# EAGLE design mapleCUx_large_085-MAPLE-unten (EAGLE 7.3.0)
MAPLE-CUx Large Version
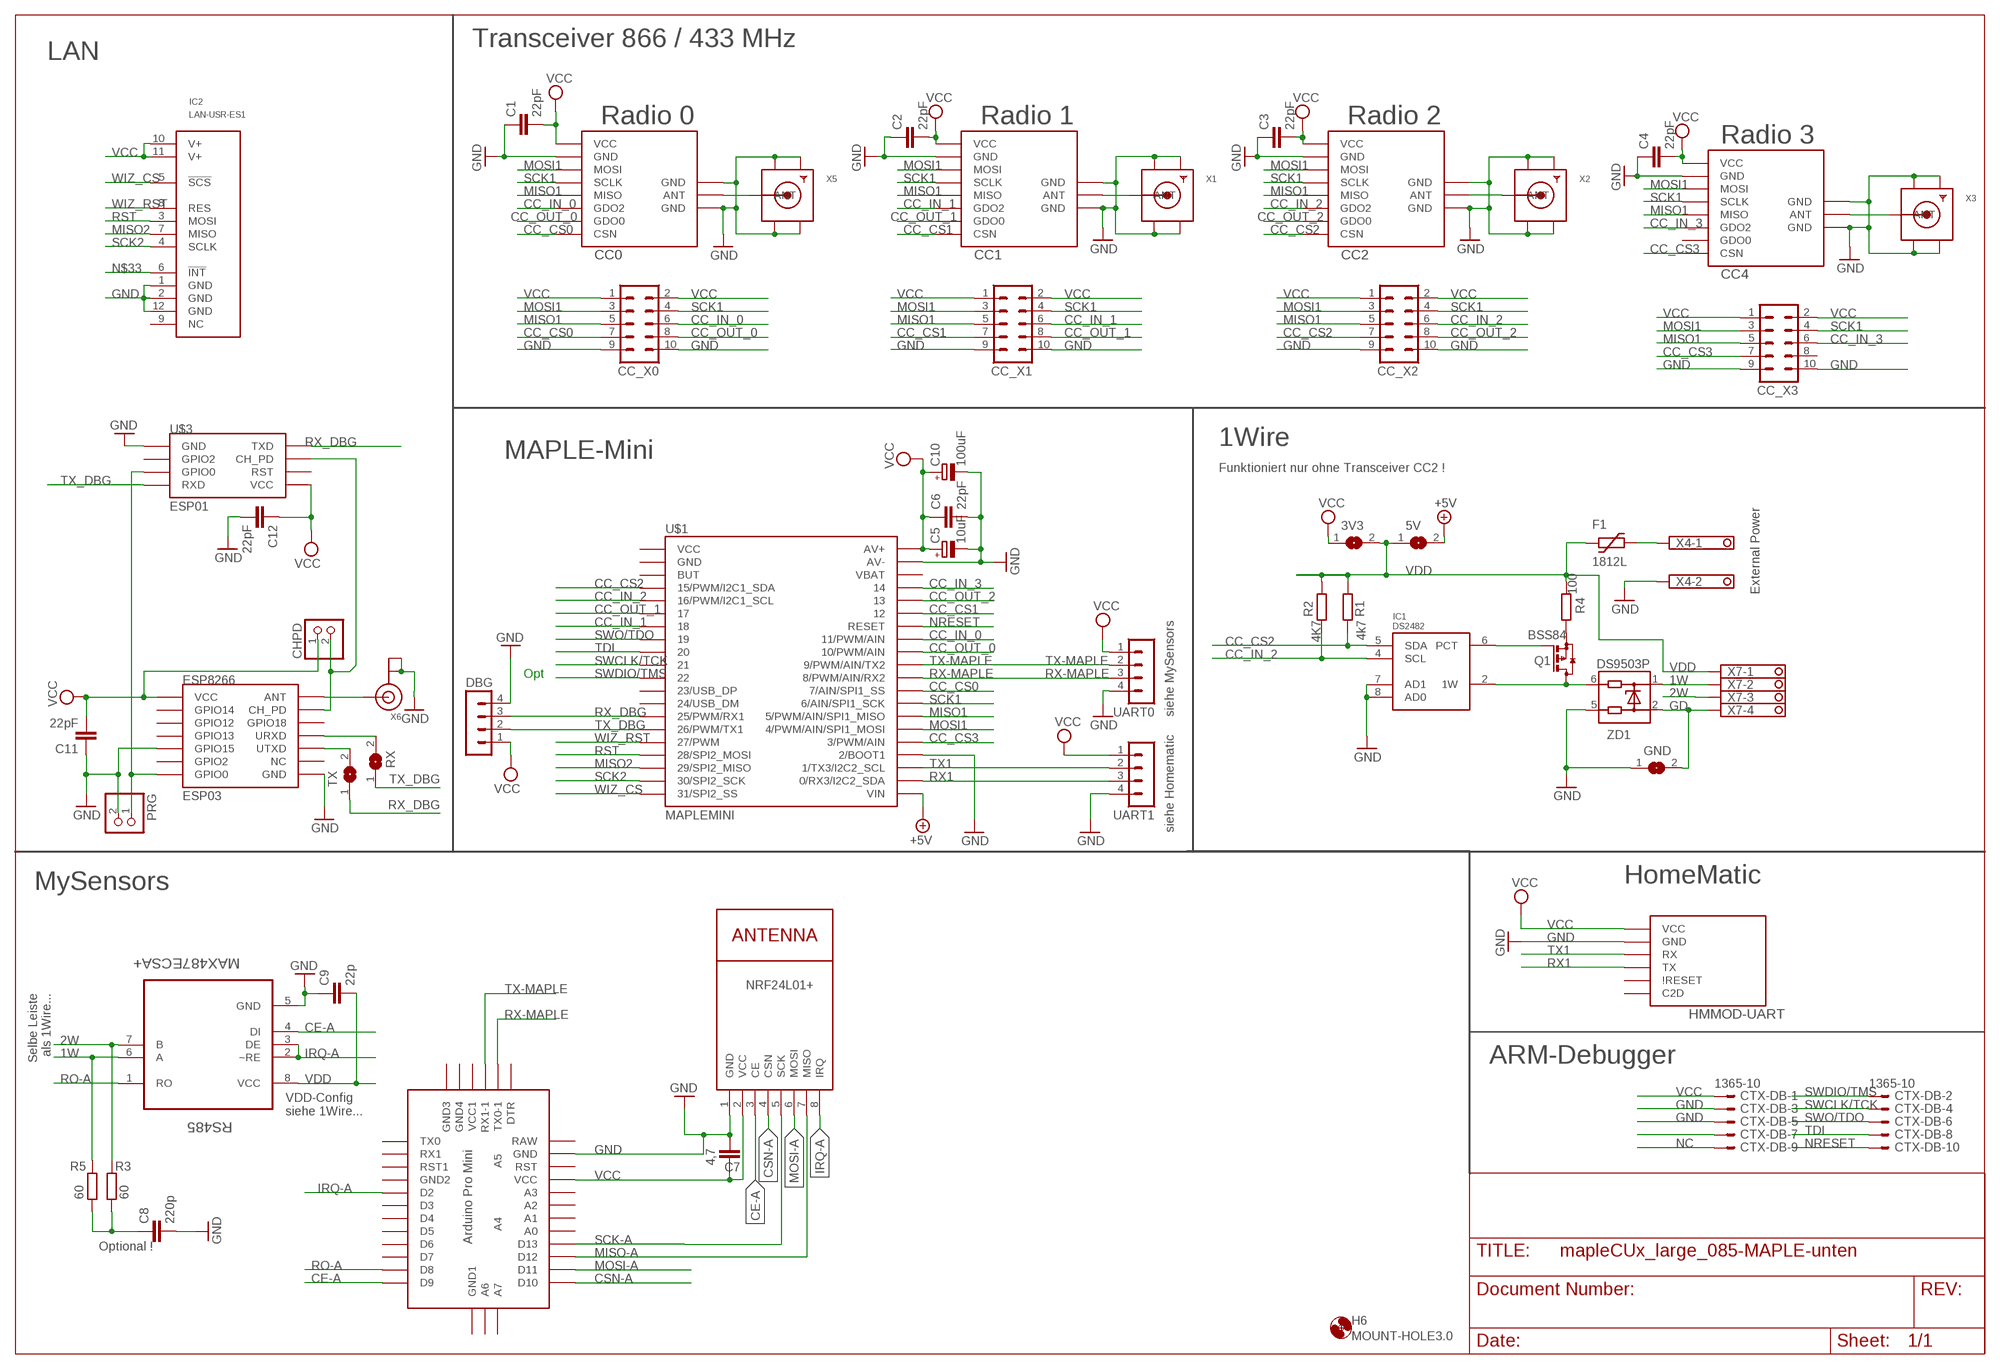
[diagram p0: schematic, sheet 1]

## Parts
3V3  SJ  [SJ]
5V  SJ  [SJ]
C1  22pF  C-EUC0805  [C0805]
C2  22pF  C-EUC0805  [C0805]
C3  22pF  C-EUC0805  [C0805]
C4  22pF  C-EUC0805  [C0805]
C5  10uF  CPOL-EUR/2012-12W  [R/2012-12W]
C6  22pF  C-EUC0805  [C0805]
C7  4,7  C-EUC1210  [C1210]
C8  220p  C-EUC0805  [C0805]
C9  22p  C-EUC0805  [C0805]
C10  100uF  CPOL-EUE5-8.5  [E5-8,5]
C11  22pF  C-EUC0805  [C0805]
C12  22pF  C-EUC0805  [C0805]
CC0  CC1101  CC1101_MODULE1SMD  [CC1101_MODULE1_SMD]
CC1  CC1101_MODULE1SMD  [CC1101_MODULE1_SMD]
CC2  CC1101_MODULE1SMD  [CC1101_MODULE1_SMD]
CC4  CC1101_MODULE1SMD  [CC1101_MODULE1_SMD]
CC_X0  MA05-2  [MA05-2]
CC_X1  MA05-2  [MA05-2]
CC_X2  MA05-2  [MA05-2]
CC_X3  MA05-2  [MA05-2]
CHPD  PINHD-1X2  [1X02]
CTX-DB  1365-10  [1365-10]
DBG  MA04-1  [MA04-1]
ESP8266  ESP03  [ESP03]
F1  1812L  [1812L]
GND  SJ  [SJ]
H6  MOUNT-HOLE3.0  [3,0]
HMMOD-UART  HM-MOD-UARTDIL  [HM-MOD-UART-DIL]
IC1  DS2482  DS2482-100S  [SO08]
IC2  LAN-USR-ES1  [USR-ES1]
NRF24L01+  NRF24L01+  WIRELESS-NRF24L01  [WIRELESS-NRF24L01]
PRG  PINHD-1X2  [1X02]
Q1  BSS84  [SOT23]
R1  4k7  R-EU_R0805  [R0805]
R2  4K7  R-EU_R0805  [R0805]
R3  60  R-EU_R0805  [R0805]
R4  100  R-EU_R0805  [R0805]
R5  60  R-EU_R0805  [R0805]
RS485  MAX487ECSA+  [SOIC127P600X175-8N]
RX  SJ  [SJ]
TX  SJ  [SJ]
U$1  MAPLEMINI  [20-DIP]
U$2  ABK-PRO-MINI  [ABK-PRO-MINI]
U$3  ESP01  [ESP01]
UART0  MA04-1  [MA04-1]
UART1  MA04-1  [MA04-1]
X1  SMACONNECTOR_EDGE_UFL  [SMA_EDGELAUNCH_UFL]
X2  SMACONNECTOR_EDGE_UFL  [SMA_EDGELAUNCH_UFL]
X3  SMACONNECTOR_EDGE_UFL  [SMA_EDGELAUNCH_UFL]
X4  1751248  [1751248]
X5  SMACONNECTOR_EDGE_UFL  [SMA_EDGELAUNCH_UFL]
X6  ANTENNA_U.FL  [U.FL]
X7  1751264  [1751264]
ZD1  DS9503P  [TSOC6]

## Nets
1W: R5.2 RS485.6(A) X7.2 ZD1.1
2W: R3.2 RS485.7(B) X7.3
+5V [PWR]: 5V.2 U$1.21(VIN)
CC_CS0: CC0.CSN CC_X0.7 U$1.29(7/AIN/SPI1_SS)
CC_CS1: CC1.CSN CC_X1.7 U$1.35
CC_CS2: CC2.CSN CC_X2.7 IC1.5(SDA) R1.2 U$1.4(15/PWM/I2C1_SDA)
CC_CS3: CC4.CSN CC_X3.7 U$1.25(3/PWM/AIN)
CC_IN_0: CC0.GDO2 CC_X0.6 U$1.33(11/PWM/AIN)
CC_IN_1: CC1.GDO2 CC_X1.6 U$1.7
CC_IN_2: CC2.GDO2 CC_X2.6 IC1.4(SCL) R2.2 U$1.5(16/PWM/I2C1_SCL)
CC_IN_3: CC4.GDO2 CC_X3.6 U$1.37
CC_OUT_0: CC0.GDO0 CC_X0.8 U$1.32(10/PWM/AIN)
CC_OUT_1: CC1.GDO0 CC_X1.8 U$1.6
CC_OUT_2: CC2.GDO0 CC_X2.8 U$1.36
CE-A: NRF24L01+.3(CE) RS485.4(DI) U$2.D9
CSN-A: NRF24L01+.4(CSN) U$2.D10
GD [PWR]: GND.2 X7.4 ZD1.2
GND [PWR]: C1.1 C2.1 C3.1 C4.1 C5.- C6.2 C7.1 C8.2 C9.1 C10.- C11.1 C12.2 CC0.GND@0(GND) CC0.GND@1(GND) CC0.GND@2(GND) CC1.GND@0(GND) CC1.GND@1(GND) CC1.GND@2(GND) CC2.GND@0(GND) CC2.GND@1(GND) CC2.GND@2(GND) CC4.GND@0(GND) CC4.GND@1(GND) CC4.GND@2(GND) CC_X0.9 CC_X0.10 CC_X1.9 CC_X1.10 CC_X2.9 CC_X2.10 CC_X3.9 CC_X3.10 CTX-DB.3 CTX-DB.5 DBG.4 ESP8266.GND ESP8266.GPIO15 GND.1 HMMOD-UART.2(GND) IC1.7(AD1) IC1.8(AD0) IC2.1(GND) IC2.2(GND) IC2.12(GND) NRF24L01+.1(GND) PRG.2 RS485.5(GND) U$1.24(2/BOOT1) U$1.39(AV-) U$2.GND U$3.GND UART0.4 UART1.4 X1.GND@1(GND1) X1.GND@2(GND2) X1.GND@3(GND3) X1.GND@4(GND4) X2.GND@1(GND1) X2.GND@2(GND2) X2.GND@3(GND3) X2.GND@4(GND4) X3.GND@1(GND1) X3.GND@2(GND2) X3.GND@3(GND3) X3.GND@4(GND4) X4.2 X5.GND@1(GND1) X5.GND@2(GND2) X5.GND@3(GND3) X5.GND@4(GND4) X6.1(GND) X6.2(GND) ZD1.5
IRQ-A: NRF24L01+.8(IRQ) RS485.2(~RE) RS485.3(DE) U$2.D2
MISO1: CC0.MISO CC1.MISO CC2.MISO CC4.MISO CC_X0.5 CC_X1.5 CC_X2.5 CC_X3.5 U$1.27(5/PWM/AIN/SPI1_MISO)
MISO2: IC2.7(MISO) U$1.18(29/SPI2_MISO)
MISO-A: NRF24L01+.7(MISO) U$2.D12
MOSI1: CC0.MOSI CC1.MOSI CC2.MOSI CC4.MOSI CC_X0.3 CC_X1.3 CC_X2.3 CC_X3.3 U$1.26(4/PWM/AIN/SPI1_MOSI)
MOSI-A: NRF24L01+.6(MOSI) U$2.D11
N$1: CC1.ANT X1.P(ANT)
N$2: CC4.ANT X3.P(ANT)
N$3: CC2.ANT X2.P(ANT)
N$4: CC0.ANT X5.P(ANT)
N$8: CTX-DB.7
N$11: ESP8266.GPIO0 PRG.1 U$3.GPIO0
N$12: ESP8266.ANT X6.3(SIGNAL)
N$17: CHPD.2 ESP8266.CH_PD U$3.CH_PD
N$18: ESP8266.URXD RX.2
N$19: ESP8266.UTXD TX.2
N$21: C8.1 R3.1 R5.1
N$33: IC2.6(!INT!)
N$45 [PWR]: F1.P$2 X4.1
N$47: IC1.6(PCT) Q1.1(G)
N$48: IC1.2(1W) Q1.3(D) ZD1.6
N$52: Q1.2(S) R4.1
NC: CTX-DB.9
NRESET: CTX-DB.10 U$1.34(RESET)
RO-A: RS485.1(RO) U$2.D8
RST: IC2.3(MOSI) U$1.17(28/SPI2_MOSI)
RX1: HMMOD-UART.5(TX) U$1.22(0/RX3/I2C2_SDA) UART1.3
RX-MAPLE: U$1.30(8/PWM/AIN/RX2) U$2.TX0-1 UART0.3
RX_DBG: DBG.3 TX.1 U$1.14(25/PWM/RX1) U$3.TX(TXD)
SCK1: CC0.SCLK CC1.SCLK CC2.SCLK CC4.SCLK CC_X0.4 CC_X1.4 CC_X2.4 CC_X3.4 U$1.28(6/AIN/SPI1_SCK)
SCK2: IC2.4(SCLK) U$1.19(30/SPI2_SCK)
SCK-A: NRF24L01+.5(SCK) U$2.D13
SWCLK/TCK: CTX-DB.4 U$1.10
SWDIO/TMS: CTX-DB.2 U$1.11
SWO/TDO: CTX-DB.6 U$1.8
TDI: CTX-DB.8 U$1.9
TX1: HMMOD-UART.6(RX) U$1.23(1/TX3/I2C2_SCL) UART1.2
TX-MAPLE: U$1.31(9/PWM/AIN/TX2) U$2.RX1-1 UART0.2
TX_DBG: DBG.2 RX.1 U$1.15(26/PWM/TX1) U$3.RX(RXD)
VCC [PWR]: 3V3.1 C1.2 C2.2 C3.2 C4.2 C5.+ C6.1 C7.2 C10.+ C11.2 C12.1 CC0.VCC CC1.VCC CC2.VCC CC4.VCC CC_X0.1 CC_X0.2 CC_X1.1 CC_X1.2 CC_X2.1 CC_X2.2 CC_X3.1 CC_X3.2 CHPD.1 CTX-DB.1 DBG.1 ESP8266.VCC HMMOD-UART.1(VCC) IC2.10(V+) IC2.11(V+) NRF24L01+.2(VCC) U$1.40(AV+) U$2.VCC U$3.VCC UART0.1 UART1.1
VDD [PWR]: 3V3.2 5V.1 C9.2 F1.P$1 R1.1 R2.1 R4.2 RS485.8(VCC) X7.1
WIZ_CS: IC2.5(!SCS!) U$1.20(31/SPI2_SS)
WIZ_RST: IC2.8(RES) U$1.16(27/PWM)
Unconnected: CC4.GDO0 CC_X3.8 ESP8266.GPIO2 ESP8266.GPIO12 ESP8266.GPIO13 ESP8266.GPIO14 ESP8266.GPIO18 ESP8266.NC HMMOD-UART.3(C2D) HMMOD-UART.4(\!RESET) IC2.9(NC) U$1.1(VCC) U$1.2(GND) U$1.3(BUT) U$1.12(23/USB_DP) U$1.13(24/USB_DM) U$1.38(VBAT) U$2.A0 U$2.A1 U$2.A2 U$2.A3 U$2.A4 U$2.A5 U$2.A6 U$2.A7 U$2.D3 U$2.D4 U$2.D5 U$2.D6 U$2.D7 U$2.DTR U$2.GND1(GND2) U$2.GND2(GND3) U$2.GND3(GND4) U$2.GND4(GND1) U$2.RAW U$2.RST U$2.RST1 U$2.RX1 U$2.TX0 U$2.VCC1 U$3.GPIO2 U$3.RST

## Notes on the sheet
- Transceiver 866 / 433 MHz
- LAN
- Radio 0 | Radio 1 | Radio 2
- Radio 3
- 1Wire
- MAPLE-Mini
- Funktioniert nur ohne Transceiver CC2 !
- External Power
- Opt
- siehe MySensors
- siehe Homematic
- MySensors | HomeMatic
- Selbe Leiste
  als 1Wire...
- ARM-Debugger
- VDD-Config
  siehe 1Wire...
- Optional !

## Power pins joined to a net without a drawn wire
GND: IC1.3(GND)
VDD: IC1.1(VDD)

## Library data of the parts
3V3 5V GND RX TX = jumper:SJ: SMD solder JUMPER
C1-C4 C6-C9 C11 C12 = rcl:C-EU: CAPACITOR, European symbol
C5 C10 = rcl:CPOL-EU: POLARIZED CAPACITOR, European symbol
CC0 CC1 CC2 CC4 = wireless:CC1101_MODULE1: CC1101 wireless module for 433/868 MHz (sold from Aliexpress). DIL version for mounting with pin header (and SMD soldering) and SMD only variant available.
CC_X0 CC_X1-CC_X3 = con-lstb:MA05-2: PIN HEADER; OC_FARNELL: unknown; OC_NEWARK: unknown
CHPD PRG = pinhead:PINHD-1X2: PIN HEADER
CTX-DB = con-leotronics:1365-10: DUAL ROW STRAIGHT HEADER 1364 SERIES. 1.27mm x 1.27mm. Without Fixing Post. SMT Source: http://www.leotronics.co.uk/Conexcon/Data%20Sheets/sec.%20A/1364ing.pdf; OC_FARNELL: unknown; OC_NEWARK: unknown
DBG UART0 UART1 = con-lstb:MA04-1: PIN HEADER; OC_FARNELL: unknown; OC_NEWARK: unknown
ESP8266 = esp8266modules:ESP03: ESP8266 Wifi module 03; DIMENSIONS: 17.3 x 12.1 mm; PINS: 14; PITCH: 0.078" / 2 mm
F1 = ptc-littlefuse:1812L
H6 = holes:MOUNT-HOLE: MOUNTING HOLE with drill center marker
HMMOD-UART = wireless:HM-MOD-UART: eQ3 HM-MOD-UART-AW-SH2 wireless module for 868 MHz. DIL version for mounting with pin header (antenna upwards) and SMD variant available (antenna downwards).
IC1 = 1wire:DS2482-100: I2C to 1-Wire Host Adapter/Line Driver This device is a onewire host and I2C interface in one chip. It provides the complete DC/AC requirements for onewire communication, including overdrive speed mode, but, unlike the DS2480B chip, no 12V EPROM programming. Notes: For overdrive speed and 5V EEPROM programming, an external active pullup circuit must be connected to the 1W, VDD and PCT pin. See the datasheet for details. The lower two I2C adress bits of the chip can be selected by external pins, so up to 4 chips may be connected to the same I2C bus. Author: Orginal device and description from Giovanni Varasano <giovanni.varasano@fastwebnet.it> Improved by Jan Kandziora <jjj@gmx.de>
IC2 = Martin-Communication:LAN-USR-ES1
NRF24L01+ = diy-modules:WIRELESS-NRF24L01: 2.4 GHz Wireless Module based on NRF24L01 chip
Q1 = transistor-small-signal:BSS84: P-CHANNEL MOS FET
R1-R5 = rcl:R-EU_: RESISTOR, European symbol
RS485 = Maxim_By_element14_Batch_1:MAX487ECSA+: Low-Power, Slew-Rate-Limited RS-485/RS-422 Transceivers; MPN: MAX487ECSA+; OC_FARNELL: 9724532; OC_NEWARK: 68K4803; PACKAGE: SOIC-8; SUPPLIER: Maxim
U$1 = maplemini-small:MAPLEMINI
U$2 = Arduino-clone:ABK-PRO-MINI: ABK Pro-Mini Arduino Clone
U$3 = esp8266modules:ESP01: ESP8266 Wifi module 01
X1-X3 X5 = adafruit:SMACONNECTOR: SMA Connector 90° DIP SMA Connector, 50 Ohm (4UConnector: 07259)
X4 = con-phoenix-350:1751248: MKDS 1/ 2-3,5 Printklemme Nennstrom: 10 A Bemessungsspannung: 160 V Raster: 3,5 mm Polzahl: 2 Montageart: Löten Anschlussart: Schraubanschluss Anschlussrichtung vom Leiter zur Platine: 0° Source: http://eshop.phoenixcontact.com .. 1751248.pdf; OC_FARNELL: unknown; OC_NEWARK: unknown
X6 = adafruit:ANTENNA_U.FL: U.FL Antenna Connector
X7 = con-phoenix-350:1751264: MKDS 1/ 4-3,5 Printklemme Nennstrom: 10 A Bemessungsspannung: 160 V Raster: 3,5 mm Polzahl: 4 Montageart: Löten Anschlussart: Schraubanschluss Anschlussrichtung vom Leiter zur Platine: 0° Source: http://eshop.phoenixcontact.com .. 1751264.pdf; MPN: 1751264; OC_FARNELL: unknown; OC_NEWARK: 10R0934
ZD1 = 1wire:DS9503: ESD Protection Diode with Resistors This ESD protection diode is designed especially for onewire host interfaces. Unlike the DS9502, it has two additional 5Ohm resitors in the 1W and GND line. Pin 5 and 6 have to be connected to the host side, pin 1 und 2 to the network side. The 1W line is through pin 1 and 6, the GND line is through pin 2 and 5. Author: Jan Kandziora <jjj@gmx.de>

## Net classes
0 default: width 0.305 mm
1 PWR: width 0.457 mm

## Board
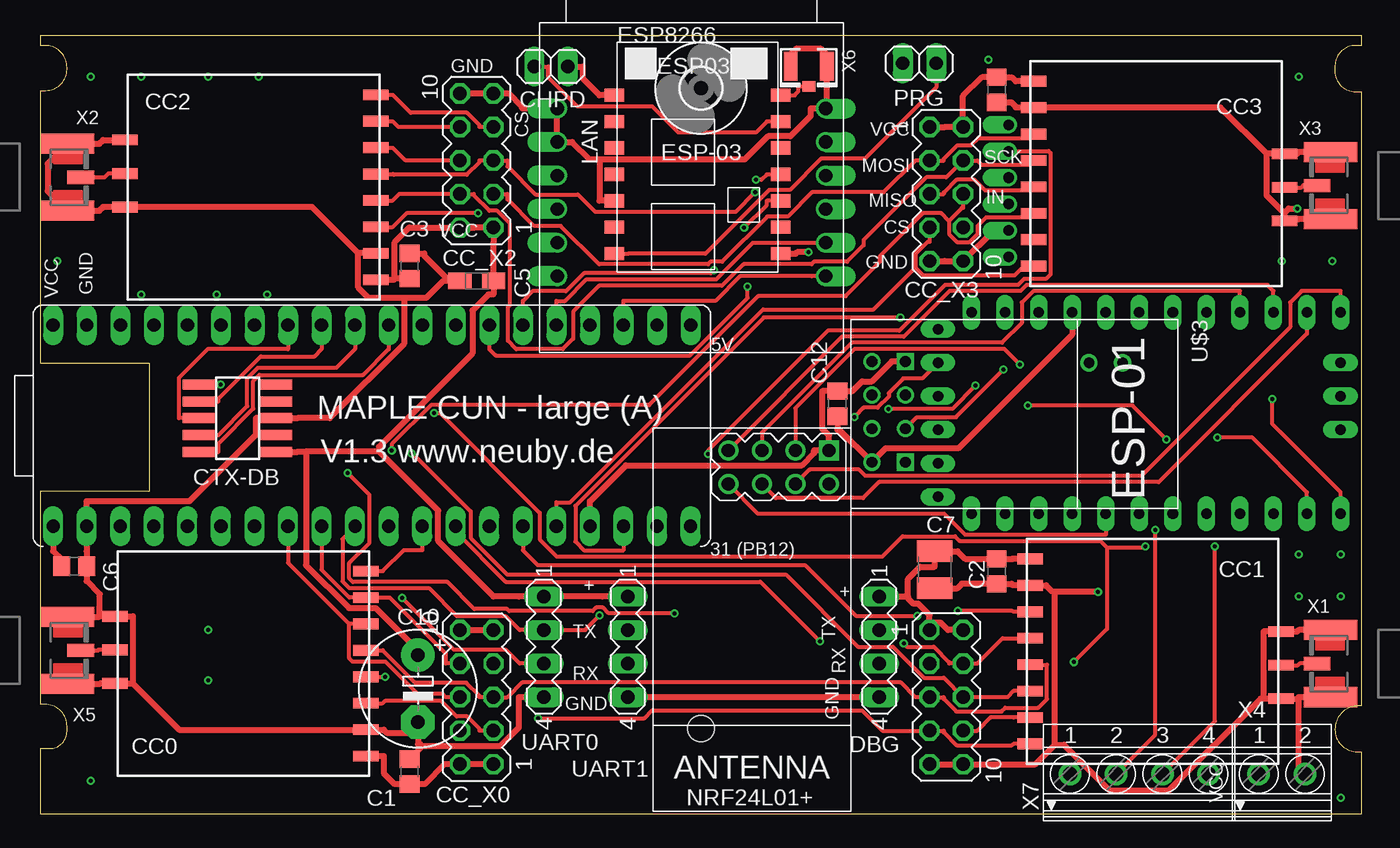
[diagram p1: board, top side]
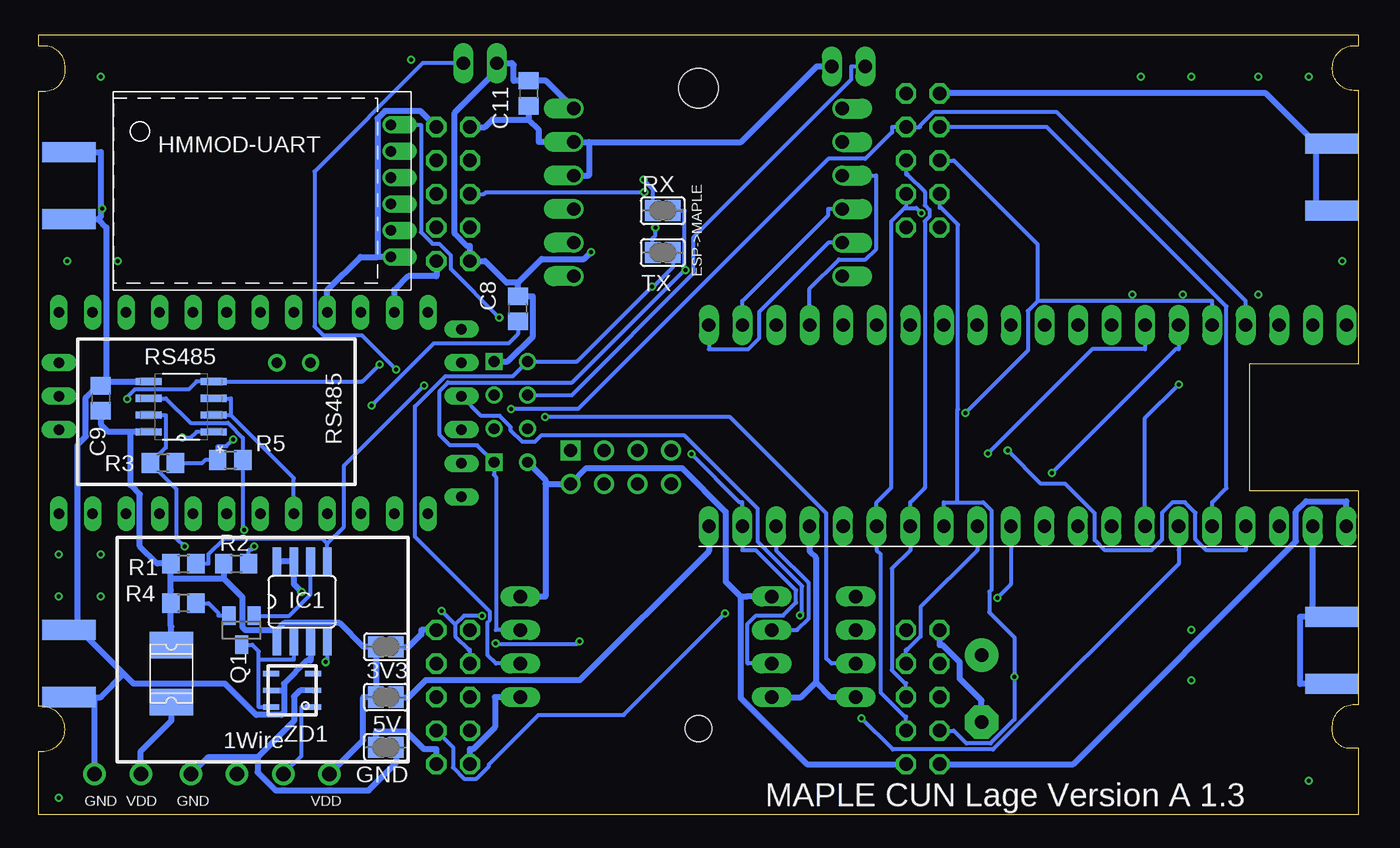
[diagram p2: board, bottom side, seen from below]

Size 100 x 59 mm. Coordinates in mm from the lower left corner, seen from the top.
Outline: 0,0 0,5 0.71,5 arc90 2,6.29 2,6.67 arc90 0.32,8.35 0,8.35 0,24.51 8.26,24.51 8.26,34.16 0,34.16 0,54.83 0.39,54.83 arc90 2,56.44 2,56.57 arc90 0.33,58.24 0,58.24 0,59 100,59 100,58.24 99.54,58.24 arc90 98,56.7 98,56.41 arc90 99.41,54.75 100,54.75 100,8.24 99.8,8.24 arc90 98,6.44 arc90 99.69,4.75 100,4.75 100,0 0,0
Copper layers (1*16): Top 0.035mm / dielectric 1.5mm / Bottom 0.035mm
Design rules "SeeedStudio_2layer_DRU_no_angle_20140221": minimum track width 6mil, minimum drill 12mil, track to track 6mil, track to pad 6mil, pad to pad 6mil, via to via 6mil, smd to smd 0mil, copper to edge 10mil, drill to drill 10mil, minimum pad ring 10mil, minimum via ring 6mil, stop-mask expansion 2mil, vias tented up to drill 100mil, thermal gap 10mil
Holes 2 mm at 50,6.5
tRestrict: area 0,58.6 to 100,59; area 45.7,0 to 62.2,7
bRestrict: area 0,58.6 to 100,59; area 0,58.6 to 100,59; area 45.7,0 to 62.2,7

### Footprints (pad centres in the part's own frame; a part is rotated, then mirrored left to right if it is on the bottom)
SJ = smd 1.168 x 1.6: 1 -0.762,0; 2 0.762,0
C0805 = smd 1.3 x 1.5: 1 -0.95,0; 2 0.95,0
R/2012-12W = smd 1.75 x 1.26: + 1.275,0; - -1.275,0
C1210 = smd 1.6 x 2.7: 1 -1.4,0; 2 1.4,0
E5-8,5 = drill 1.016 pad 2.54: + -2.54,0 | drill 1.016 pad 2.54 octagon: - 2.54,0
CC1101_MODULE1_SMD = smd 1.93 x 0.813: ANT 19,5.96; CSN 0,0; GDO0 0,2; GDO2 0,4; GND@0 0,12; GND@1 19,8.5; GND@2 19,3.42; MISO 0,6; MOSI 0,10; SCLK 0,8; VCC 0,14
MA05-2 = drill 1.016 octagon: 1 -5.08,-1.27; 2 -5.08,1.27; 3 -2.54,-1.27; 4 -2.54,1.27; 5 0,-1.27; 6 0,1.27; 7 2.54,-1.27; 8 2.54,1.27; 9 5.08,-1.27; 10 5.08,1.27
1X02 = drill 1.016 long: 1 -1.27,0; 2 1.27,0
1365-10 = smd 0.76 x 2.4: 1 -2.54,-2.95; 2 -2.54,2.95; 3 -1.27,-2.95; 4 -1.27,2.95; 5 0,-2.95; 6 0,2.95; 7 1.27,-2.95; 8 1.27,2.95; 9 2.54,-2.95; 10 2.54,2.95
MA04-1 = drill 1.016 long: 1 -3.81,0; 2 -1.27,0; 3 1.27,0; 4 3.81,0
ESP03 = smd 1.5 x 1: ANT 7.4,4.8; CH_PD 7.4,2.8; GND 7.4,-7.2; GPIO0 -5.2,-7.2; GPIO2 -5.2,-5.2; GPIO12 -5.2,0.8; GPIO13 -5.2,-1.2; GPIO14 -5.2,2.8; GPIO15 -5.2,-3.2; GPIO18 7.4,0.8; NC 7.4,-5.2; URXD 7.4,-1.2; UTXD 7.4,-3.2; VCC -5.2,4.8
1812L = smd 2.03 x 3.3: P$1 -2.16,0; P$2 2.16,0
3,0 = hole 3: 0,0
HM-MOD-UART-DIL = drill 0.8 offset: 1 0,12; 2 0,10; 3 0,8; 4 0,6; 5 0,4; 6 0,2
SO08 = smd 0.66 x 2.032: 1 -1.905,-3.073; 2 -0.635,-3.073; 3 0.635,-3.073; 4 1.905,-3.073; 5 1.905,3.073; 6 0.635,3.073; 7 -0.635,3.073; 8 -1.905,3.073
USR-ES1 = drill 1 pad 1.35 offset: 1 -10.16,5.715; 2 -10.16,3.175; 3 -10.16,0.635; 4 -10.16,-1.905; 5 -10.16,-4.445; 6 -10.16,-6.985; 7 10.16,-6.985; 8 10.16,-4.445; 9 10.16,-1.905; 10 10.16,0.635; 11 10.16,3.175; 12 10.16,5.715
WIRELESS-NRF24L01 = drill 1 square: 1 -12.7,6.35 | drill 1: 2 -10.16,6.35; 3 -12.7,3.81; 4 -10.16,3.81; 5 -12.7,1.27; 6 -10.16,1.27; 7 -12.7,-1.27; 8 -10.16,-1.27
SOT23 = smd 1 x 1.4: 1 -0.95,-1.1; 2 0.95,-1.1; 3 0,1.1
R0805 = smd 1.3 x 1.5: 1 -0.95,0; 2 0.95,0
SOIC127P600X175-8N = smd 1.981 x 0.533: 1 -2.464,1.905; 2 -2.464,0.635; 3 -2.464,-0.635; 4 -2.464,-1.905; 5 2.464,-1.905; 6 2.464,-0.635; 7 2.464,0.635; 8 2.464,1.905
20-DIP = drill 1.016 pad 1.27 long: 1 -24.13,-7.62; 2 -21.59,-7.62; 3 -19.05,-7.62; 4 -16.51,-7.62; 5 -13.97,-7.62; 6 -11.43,-7.62; 7 -8.89,-7.62; 8 -6.35,-7.62; 9 -3.81,-7.62; 10 -1.27,-7.62; 11 1.27,-7.62; 12 3.81,-7.62; 13 6.35,-7.62; 14 8.89,-7.62; 15 11.43,-7.62; 16 13.97,-7.62; 17 16.51,-7.62; 18 19.05,-7.62; 19 21.59,-7.62; 20 24.13,-7.62 | drill 1 pad 1.27 long: 21 24.13,7.62; 22 21.59,7.62; 23 19.05,7.62; 24 16.51,7.62; 25 13.97,7.62; 26 11.43,7.62; 27 8.89,7.62; 28 6.35,7.62; 29 3.81,7.62; 30 1.27,7.62; 31 -1.27,7.62; 32 -3.81,7.62; 33 -6.35,7.62; 34 -8.89,7.62; 35 -11.43,7.62; 36 -13.97,7.62; 37 -16.51,7.62; 38 -19.05,7.62; 39 -21.59,7.62; 40 -24.13,7.62
ABK-PRO-MINI = drill 0.8 long: A0 10.16,-3.81; A1 10.16,-6.35; A2 10.16,-8.89; A3 10.16,-11.43; A6 3.81,-21.59; A7 6.35,-21.59; D2 -5.08,-3.81; D3 -5.08,-6.35; D4 -5.08,-8.89; D5 -5.08,-11.43; D6 -5.08,-13.97; D7 -5.08,-16.51; D8 -5.08,-19.05; D9 -5.08,-21.59; D10 10.16,-21.59; D11 10.16,-19.05; D12 10.16,-16.51; D13 10.16,-13.97; DTR 8.89,8.89; GND 10.16,3.81; GND1 -5.08,-1.27; GND2 -3.81,8.89; GND3 -1.27,8.89; GND4 1.27,-21.59; RAW 10.16,6.35; RST 10.16,1.27; RST1 -5.08,1.27; RX1 -5.08,3.81; RX1-1 3.81,8.89; TX0 -5.08,6.35; TX0-1 6.35,8.89; VCC 10.16,-1.27; VCC1 1.27,8.89 | drill 0.8: A4 6.35,-5.08; A5 6.35,-2.54
ESP01 = drill 0.8: CH_PD -1.285,-8.178; GPIO0 1.255,-5.638; GPIO2 -1.285,-5.638; RST 1.255,-8.178; TX -3.825,-8.178; VCC 3.795,-8.178 | drill 0.8 square: GND -3.825,-5.638; RX 3.795,-5.638
SMA_EDGELAUNCH_UFL = smd 4.064 x 1.524: GND@1 2.032,-2.54; GND@2 2.032,2.54 | smd 4.064 x 1.524 bottom: GND@3 2.032,2.54; GND@4 2.032,-2.54 | smd 2.032 x 1.016: P 3.048,0
1751248 = drill 1.1 pad 1.7: 1 -1.75,-0.1; 2 1.75,-0.1
U.FL = smd 2.2 x 1.05: 1 0,1.375; 2 0,-1.375 | smd 0.8 x 1: 3 1.525,0
1751264 = drill 1.1 pad 1.7: 1 -5.25,-0.1; 2 -1.75,-0.1; 3 1.75,-0.1; 4 5.25,-0.1
TSOC6 = smd 0.406 x 1.219: 1 -1.27,-1.6; 2 0,-1.6; 3 1.27,-1.6; 4 1.27,1.6; 5 0,1.6; 6 -1.27,1.6

### Placement (x,y rotation side)
3V3  73.66,12.7 180 bottom
5V  73.66,8.89 0 bottom
C1  27.94,3.25 270 top
C2  72.39,18.41 90 top
C3  27.94,41.55 270 top
C4  72.39,54.88 90 top
C5  33.02,40.4 0 top
C6  2.54,18.81 0 top
C7  67.69,18.54 90 top
C8  63.67,38.3 90 bottom
C9  95.25,31.52 270 bottom
C10  28.57,9.53 270 top
C11  62.87,54.61 270 bottom
C12  60.33,31.11 90 top
CC0  24.64,18.43 180 top
CC1  74.93,5.35 0 top
CC2  25.4,54.5 180 top
CC4  75.18,41.53 0 top
CC_X0  33.02,8.89 90 top
CC_X1  68.58,8.89 270 top
CC_X2  33.02,49.53 90 top
CC_X3  68.58,46.99 270 top
CHPD  38.64,56.64 180 top
CTX-DB  14.92,30.01 90 top
DBG  63.5,12.7 270 top
ESP8266  48.64,49.67 0 top
F1  89.92,10.67 270 bottom
GND  73.66,5.08 0 bottom
H6  50,55 0 top
HMMOD-UART  73.28,54.23 180 bottom
IC1  80.01,16.13 0 bottom
IC2  49.28,47.75 0 top
NRF24L01+  53.34,14.88 270 top
PRG  66.55,56.9 180 top
Q1  84.6,13.95 180 bottom
R1  89,19 0 bottom
R2  85,19 0 bottom
R3  90.55,26.61 180 bottom
R4  89,16 180 bottom
R5  85.45,26.84 0 bottom
RS485  89.17,30.89 180 bottom
RX  52.7,45.72 180 bottom
TX  52.7,42.55 180 bottom
U$1  25.08,29.45 180 bottom
U$2  76.83,27.87 90 top
U$3  71.12,30.48 270 top
UART0  38.1,12.7 270 top
UART1  44.45,12.7 270 top
X1  99.69,11.43 180 top
X2  0,48.26 0 top
X3  99.69,47.62 180 top
X4  93.98,3.17 0 top
X5  0,12.43 0 top
X6  58.17,56.66 270 top
X7  83.19,3.17 0 top
ZD1  80.77,9.4 90 bottom

### Tracks (layer width: path | path; a pad name or v marks a point on that pad's centre or on a via)
1W  (via drill 0.3 pad 0.61)
  Top 0.305: X7.2 84.4,6.04 v84.4,21.55
  Bottom 0.305: v84.4,21.55 84.5,21.66 R5.2 84.5,28.52 85.63,29.65 88.47,29.65 90.34,31.52 RS485.6 | ZD1.1 80.09,8.13 80.09,4.42 X7.2
2W  (via drill 0.3 pad 0.61)
  Top 0.305: X7.3 88.92,7.06 v88.92,20.29
  Bottom 0.305: v88.92,20.29 89.53,20.91 89.53,24.65 R3.2 90.34,27.78 90.34,30.25 RS485.7
+5V
  Bottom 0.457: 5V.2 71.93,8.89 70.66,10.16 58.99,10.16 49.21,19.94 U$1.21
CC_CS0
  Top 0.305: CC0.CSN 25.91,18.43 27.49,20.02 28.89,20.02 U$1.29
  Bottom 0.305: CC_X0.7 34.29,12.5 34.18,12.5 33.19,13.49 33.19,15.72 28.89,20.02 U$1.29
CC_CS1  (via drill 0.3 pad 0.61)
  Top 0.305: v37.65,7.29 45.71,7.29 46.3,7.88 62.2,7.88 63.73,6.35 CC_X1.7 68.38,6.35 68.38,6.22 69.35,5.25 73.56,5.25 73.66,5.35 CC1.CSN
  Bottom 0.305: U$1.35 13.65,20.02 13.65,18.98 27.7,4.93 35.29,4.93 v37.65,7.29
CC_CS2  (via drill 0.3 pad 0.61)
  Top 0.305: v70.78,32.48 69.02,30.72 v64.19,30.72 | CC2.CSN 26.67,54.5 28.03,53.14 32.29,53.14 33.22,52.2 33.22,52.07 CC_X2.7
  Bottom 0.305: U$1.4 8.57,38.9 22.86,53.18 32.22,53.18 33.22,52.18 33.22,52.07 CC_X2.7 35.36,52.07 35.36,51.67 37.37,49.66 40.17,49.66 59.11,30.72 v64.19,30.72 | R1.2 87.09,19 87.09,19.72 85.89,20.92 78.5,20.92 78.11,20.52 | IC1.5 78.11,20.52 | 78.11,20.52 76.83,21.79 76.83,26.42 v70.78,32.48
CC_CS3
  Top 0.305: 66.24,41.42 66.82,40.84 73.76,40.84 74.45,41.53 CC4.CSN | 66.24,41.42 66.24,42.44 67.18,43.38 67.31,43.38 CC_X3.7 | 66.24,41.42 63.07,38.25 54.71,38.25 40.1,23.64 39.05,23.64 U$1.25
CC_IN_0
  Top 0.305: CC_X0.6 30.68,8.89 30.44,9.13 28.56,9.13 26.12,11.58 23.62,11.58 23.37,11.83 23.37,14.43 | CC0.GDO2 23.37,14.43 | U$1.33 18.73,19.07 23.37,14.43
CC_IN_1  (via drill 0.3 pad 0.61)
  Top 0.305: v28.1,27.34 28.18,27.34 32.56,22.96 32.56,20.95 35.33,18.17 56.42,18.17 61.89,12.7 64.53,12.7 66.87,10.36 68.38,10.36 CC_X1.6 73.2,8.89 73.66,9.35 CC1.GDO2
  Bottom 0.305: U$1.7 16.19,35.24 20.2,35.24 v28.1,27.34
CC_IN_2  (via drill 0.3 pad 0.61)
  Top 0.305: 80.75,20.22 83.55,20.22 v83.64,20.3 | 80.75,20.22 80.75,14.06 v78.23,11.54 | v29.8,30.4 30.23,30.4 37.78,22.85 37.78,20.83 39.08,19.54 63.73,19.54 65.26,21.06 69.23,21.06 69.58,20.72 80.25,20.72 80.75,20.22 | CC2.GDO2 26.67,50.5 27.64,49.53 CC_X2.6
  Bottom 0.305: R2.2 84.05,20.05 83.88,20.05 v83.64,20.3 | IC1.4 78.11,11.73 78.23,11.61 v78.23,11.54 | 24.32,38.9 25.08,38.13 25.08,35.12 v29.8,30.4 | 24.32,38.9 24.32,43.16 30.68,49.53 CC_X2.6 | 24.32,38.9 11.11,38.9 U$1.5
CC_IN_3  (via drill 0.3 pad 0.61)
  Top 0.305: 68.78,44.95 68.2,45.53 66.81,45.53 63.53,42.24 63.53,41.84 60.94,39.25 54.32,39.25 46.07,31.01 29.55,31.01 26.59,28.05 v26.59,27.57 | 68.78,44.95 68.78,43.97 69.4,43.35 70.33,43.35 70.97,43.99 70.97,44.58 71.61,45.23 74.88,45.23 CC4.GDO2 | 68.78,44.95 69.75,45.92 69.85,45.92 CC_X3.6
  Bottom 0.305: v26.59,27.57 24.07,25.05 22.24,25.05 20,22.81 20,20.79 19.22,20 15.71,20 14.92,20.79 14.92,22.84 14.12,23.64 13.17,23.64 12.38,22.85 12.38,20.84 11.55,20.02 8.57,20.02 U$1.37
CC_OUT_0
  Top 0.305: U$1.32 21.27,18.53 23.37,16.43 CC0.GDO0 25.91,16.43 26.44,16.43 30.68,12.19 30.68,11.43 CC_X0.8
CC_OUT_1  (via drill 0.3 pad 0.61)
  Top 0.305: v47.98,15.24 43.01,15.24 42.58,15.68 42.07,15.68 41.81,15.41 35.47,15.41 35.32,15.57 32.84,15.57 30.81,17.6 23.64,17.6 23.37,17.87 23.37,19.04 24.9,20.57 24.9,24.21 v23.23,25.87 | CC_X1.8 70.92,6.35 71.92,7.35 73.66,7.35 CC1.GDO0
  Bottom 0.305: CC_X1.8 68.6,5.1 68.6,3.57 67.75,2.72 66.81,2.72 65.87,3.67 65.87,3.8 62.12,7.54 55.68,7.54 v47.98,15.24 | U$1.6 13.65,35.24 13.86,35.24 v23.23,25.87
CC_OUT_2
  Top 0.305: CC2.GDO0 26.67,52.5 27.1,52.07 CC_X2.8
  Bottom 0.305: U$1.36 11.11,23.64 10.04,24.72 10.04,38.47 23.64,52.07 CC_X2.8
CE-A  (via drill 0.3 pad 0.61)
  Top 0.305: U$2.D9 98.42,24.4 93.26,29.57 v93.26,31.47 | v74.16,34.07 72.97,35.27 61.64,35.27 57.15,30.78 NRF24L01+.3
  Bottom 0.305: v93.26,31.47 93.26,31.63 92.67,32.22 88.57,32.22 88,32.79 RS485.4 75.44,32.79 v74.16,34.07
CSN-A
  Top 0.305: NRF24L01+.4 58.23,26.12 61.96,26.12 62.44,25.64 83.34,25.64 94.61,36.91 94.61,38.77 95.49,39.64 98.42,39.64 U$2.D10
GD
  Bottom 0.457: 83.38,4.33 83.38,3.21 82.01,1.83 74.97,1.83 72.9,3.9 GND.2 | 83.38,4.33 80.62,7.09 80.62,8.94 80.16,9.4 ZD1.2 | 83.38,4.33 87.18,4.33 X7.4
GND  (via drill 0.3 pad 0.61)
  Top 0.457: 94.16,45.55 94.5,45.88 v95.16,45.88 | 94.16,45.55 | 94.16,45.55 94.16,45.24 94.32,45.09 | 94.16,45.55 92.84,46.88 92.84,50.03 | 95.25,8.77 95.25,8.89 X1.GND@2 | X4.2 95.25,3.56 95.25,8.77 | 95.25,8.77 CC1.GND@2 92.58,8.77 | 76.79,5.28 77.48,5.28 80.93,1.83 85.43,1.83 92.37,8.77 92.58,8.77 | 76.79,5.28 76.79,16.87 | 76.79,5.28 75.32,3.81 CC_X1.10 CC_X1.9 | 92.58,8.77 92.58,13.85 CC1.GND@1 95.13,13.85 95.25,13.97 X1.GND@1 | 76.79,16.87 76.61,16.87 76.12,17.35 CC1.GND@0 73.58,17.35 73.58,17.4 73.52,17.46 C2.1 69.75,17.46 69.42,17.14 C7.1 | v80.07,16.87 76.79,16.87 | 2.26,50.8 2.05,50.8 0.53,49.28 0.53,47.22 X2.GND@4 4.45,45.72 4.72,46 CC2.GND@1 20.55,46 24.05,42.5 | 2.26,50.8 4.45,50.8 4.72,51.08 CC2.GND@2 | X2.GND@2 2.26,50.8 | ESP8266.GND 57.17,42.47 57.28,42.59 v58.14,42.59 | HMMOD-UART.2 72.17,44.23 CC_X3.10 68.45,41.91 CC_X3.9 | U$3.GND 64.45,34.3 62.94,32.8 62.19,32.8 61.46,32.06 C12.2 59.76,32.06 59.19,32.06 59.19,29.21 59.69,28.71 59.69,28.14 NRF24L01+.1 58.55,27.57 58.55,27.36 57.63,26.44 44.31,26.44 41.59,23.72 U$1.24 | 28.57,6.16 26.26,6.16 25.98,6.43 CC0.GND@0 10.48,6.43 6.98,9.93 | 28.57,6.16 28.57,5.33 28.75,5.33 28.91,5.17 | C10.- 28.57,6.16 | C1.1 28.91,5.17 | 28.91,5.17 | 28.91,5.17 34.8,5.17 36.2,6.57 36.2,8.89 UART0.4 | CC2.GND@0 24.05,42.5 | 27.52,39.12 24.85,39.12 24.05,39.91 24.05,42.5 | 27.52,39.12 29.2,39.12 30.49,40.4 30.96,40.4 | 27.52,39.12 27.52,35.63 21.9,30.01 19.45,30.01 CTX-DB.5 16.29,30.01 16.29,28.74 | DBG.4 UART1.4 | 39.68,50.93 39.12,51.49 IC2.1 36.47,53.47 36.47,53.57 35.43,54.61 CC_X2.9 CC_X2.10 | 39.68,50.93 40.25,50.93 41.59,49.59 42.31,49.59
  Top 0.457: IC2.2 39.68,50.93 | X6.2 56.79,57.6 57.18,57.99 59.09,57.99 59.54,57.54 X6.1 59.54,53.63 59.37,53.47 | 92.84,50.03 89.34,53.53 CC4.GND@0 73.84,53.53 73.84,53.61 73.52,53.93 C4.1 | 94.32,45.09 CC4.GND@2 | 94.32,45.09 95.25,45.09 X3.GND@2 | 92.84,50.03 CC4.GND@1 95.11,50.03 95.25,50.16 X3.GND@1 | IC2.12 59.37,53.47 | 59.37,53.47 59.25,53.47 58.3,53.47 58.3,52.9 56.76,51.36 55.07,51.36 53.3,49.59 42.31,49.59 | 42.31,49.59 42.31,46.47 ESP8266.GPIO15 | 6.98,9.93 6.98,15.01 CC0.GND@2 5.3,15.01 5.13,15.01 4.49,15.01 | 6.98,9.93 CC0.GND@1 4.49,9.93 4.45,9.89 X5.GND@1 | 4.49,15.01 4.45,14.97 X5.GND@2 | 4.49,15.01 4.49,16.68 3.49,17.68 C6.2 3.49,19.94 U$1.39 3.49,23.72 11.26,23.72 16.29,28.74 | C3.1 29.07,42.49 29.07,42.29 30.96,40.4 | C5.- 30.96,40.4 | CC_X0.10 CC_X0.9 | 16.29,28.74 17.08,28.74 CTX-DB.3
  Bottom 0.457: 95.25,45.88 v95.16,45.88 | 95.25,45.88 95.25,45.3 95.46,45.09 | 95.25,45.88 95.25,50.16 X3.GND@1 | 95.73,8.89 95.25,8.89 93.5,10.64 | X1.GND@2 95.73,8.89 | X4.2 95.73,8.89 | 93.5,10.64 96.84,13.97 | 81.38,9.4 81.38,7.75 81.59,7.54 83.49,7.54 85.85,9.9 92.77,9.9 93.5,10.64 | 81.38,9.4 81.38,9.91 79.64,11.66 79.38,11.66 IC1.3 | 64.71,56.9 68.47,53.14 68.47,43.97 67.55,43.05 67.31,43.05 CC_X3.9 66.17,41.91 64.53,40.28 63.67,40.28 | 94.83,32.79 RS485.5 | 95.25,32.74 95.2,32.79 94.83,32.79 | 95.46,45.09 94.83,44.46 94.83,32.79 | 96.84,13.97 97,14.13 97,28.03 96.4,28.63 96.4,31.59 95.25,32.74 | ZD1.5 81.38,9.4 | v80.07,16.87 80.64,17.45 IC1.7 IC1.8 | 63.67,40.28 61.88,42.07 58.66,42.07 v58.14,42.59 | 63.67,40.28 63.67,39.95 C8.2 62.54,39.24 62.54,36.21 64.45,34.3 U$3.GND | 41.12,10.01 41.12,19.47 41.59,19.94 U$1.24 | GND.1 74.42,6.26 72.09,6.26 70.78,4.95 69.85,4.95 CC_X1.10 | 41.12,10.01 40.01,8.89 UART0.4 | UART1.4 42.24,8.89 41.12,10.01 | U$2.GND 73.03,39.72 71.98,40.77 69.85,40.77 CC_X3.10 | CC_X0.10 31.75,12.83 31.51,12.83 30.23,11.54 30.23,10.29 28.57,8.64 C10.- | 3.24,50.8 7.05,54.61 CC_X2.10 | 3.24,50.8 3.24,45.72 X2.GND@4 | X3.GND@2 95.46,45.09 | 64.71,56.9 64.14,56.9 64,56.76 64,55.56 C11.1 61.53,55.56 IC2.12 | PRG.2 64.71,56.9 | X2.GND@2 3.24,50.8 | X1.GND@1 96.84,13.97 | C9.1 95.25,32.74 | CC_X1.9 67.31,4.95 67.07,4.95 65.41,6.62 65.41,8.89 DBG.4 | 3.24,14.97 3.49,15.22 U$1.39 | 3.24,14.97 4.45,14.97 4.45,9.89 X5.GND@1 | X5.GND@2 3.24,14.97
IRQ-A
  Top 0.305: NRF24L01+.8 54.33,22.77 68.41,22.77 70.01,21.18 80.64,21.18 U$2.D2
  Bottom 0.305: U$2.D2 80.64,25.48 85.41,30.25 | RS485.3 85.41,31.52 85.41,30.25 | RS485.2 85.41,30.25
MISO1  (via drill 0.3 pad 0.61)
  Top 0.305: CC1.MISO 76.2,11.35 76.2,8.74 75.55,8.09 73.04,8.09 72.76,7.81 69.33,7.81 68.38,8.76 68.38,8.89 CC_X1.5 66.78,8.89 66.24,8.89 65.14,9.99 36.46,9.99 35.36,8.89 CC_X0.5 33.22,8.89 33.22,9 32.23,9.99 28.35,9.99 25.91,12.43 CC0.MISO | v54.11,47.13 52.63,45.66 41.98,45.66 40.68,46.95 37.49,46.95 35.36,49.09 35.36,49.53 CC_X2.5 33.22,49.53 33.22,49.4 32.27,48.44 26.73,48.44 26.67,48.5 CC2.MISO | CC_X3.5 68.38,46.99 68.38,47.1 69.35,48.07 70.72,48.07 71.53,47.26 74.91,47.26 CC4.MISO
  Bottom 0.305: CC_X2.5 34.29,48.46 34.18,48.46 32.87,47.15 32.87,46.14 32.52,45.79 32.52,45.28 32.87,44.93 32.87,24.75 33.97,23.64 U$1.27 33.97,20.92 33.97,20.02 35.37,18.62 35.37,10.92 34.4,9.96 34.29,9.96 CC_X0.5 | v54.11,47.13 66.1,47.13 66.24,46.99 CC_X3.5
MISO2
  Top 0.305: IC2.7 58.38,40.77 52.97,40.77 51.1,38.9 44.13,38.9 U$1.18
MISO-A
  Top 0.305: NRF24L01+.7 60.68,36.18 65.35,36.18 68.81,39.64 74.19,39.64 74.64,40.1 92.89,40.1 93.34,39.64 U$2.D12
MOSI1  (via drill 0.3 pad 0.61)
  Top 0.305: v66.4,15.04 61.72,15.04 57.87,18.89 37.63,18.89 36.51,20.02 U$1.26 | CC_X2.3 35.36,46.99 35.36,46.59 37.37,44.58 39.38,44.58 42.28,41.67 50.54,41.67 50.73,41.85 51.61,41.85 55.03,45.28 56.57,45.28 58.41,47.12 63.83,47.12 66.24,49.53 CC_X3.3 67.84,49.53 68.38,49.53 68.38,49.66 69.4,50.69 70.45,50.69 70.99,51.23 74.88,51.23 CC4.MOSI | CC2.MOSI 26.67,44.5 27.71,45.53 v33.12,45.53 | v69.47,15.42 73.59,15.42 73.66,15.35 CC1.MOSI | CC0.MOSI 25.91,8.43 26.08,8.6 30.32,8.6 31.51,7.42 32.29,7.42 33.22,6.48 33.22,6.35 CC_X0.3
  Bottom 0.305: 34.29,45.92 33.51,45.92 v33.12,45.53 | 34.29,45.92 34.4,45.92 35.4,44.92 35.4,24.75 36.51,23.64 U$1.26 36.51,20.92 36.51,20.02 36.22,19.73 36.22,9.24 34.4,7.42 34.29,7.42 CC_X0.3 | v69.47,15.42 68.43,14.38 | 68.43,14.38 68.43,13.5 67.42,12.5 67.31,12.5 CC_X1.3 | v66.4,15.04 67.76,15.04 68.43,14.38 | CC_X2.3 34.29,45.92
MOSI-A
  Top 0.305: U$2.D11 95.89,36.42 84.65,25.18 63.49,25.18 62.28,23.97 55.68,23.97 NRF24L01+.6
N$1
  Top 0.305: CC1.ANT 95.2,11.31 95.32,11.43 X1.P
N$2
  Top 0.305: CC4.ANT 95.45,47.49 95.59,47.62 X3.P
N$3
  Top 0.305: CC2.ANT 5.13,48.54 4.85,48.26 X2.P
N$4
  Top 0.305: CC0.ANT 4.37,12.47 4.33,12.43 X5.P
N$6  (via drill 0.3 pad 0.61)
  other vias: 3.81,55.88
N$7  (via drill 0.3 pad 0.61)
  other vias: 1.27,41.91
N$9  (via drill 0.3 pad 0.61)
  other vias: 3.81,2.54
N$11  (via drill 0.3 pad 0.61)
  Top 0.305: U$3.GPIO0 66.36,30.1 69.3,30.1 v72.91,33.7 | ESP8266.GPIO0 44.5,42.47 50.33,42.47 55.15,47.3 56.73,47.3 59.1,49.67 62.42,49.67 67.82,55.07 PRG.1
  Bottom 0.305: PRG.1 70.88,56.9 79.08,48.7 79.08,36.95 78.42,36.29 75.5,36.29 v72.91,33.7
N$12
  Top 0.305: X6.3 57.36,55.13 57.36,54.74 57.1,54.47 ESP8266.ANT
N$13  (via drill 0.3 pad 0.61)
  other vias: 7.62,55.88
N$14  (via drill 0.3 pad 0.61)
  other vias: 12.7,55.88
N$16  (via drill 0.3 pad 0.61)
  other vias: 95.25,55.88
N$17
  Top 0.305: CHPD.2 38.44,56.64 38.44,55.84 40.67,53.61 46.32,53.61 48.28,51.64 54.16,51.64 54.99,52.47 ESP8266.CH_PD
  Bottom 0.305: U$3.CH_PD 59.59,31.77 50.37,40.99 50.37,43.74 38.44,55.67 38.44,56.64 CHPD.2
N$18  (via drill 0.3 pad 0.61)
  Top 0.305: v54.17,48.06 54.58,48.06 54.99,48.47 ESP8266.URXD
  Bottom 0.305: v54.17,48.06 53.47,47.36 RX.2
N$19  (via drill 0.3 pad 0.61)
  Top 0.305: ESP8266.UTXD 54.99,46.47 54.99,46.15 v53.27,44.44
  Bottom 0.305: TX.2 53.47,43.65 53.27,43.84 v53.27,44.44
N$21  (via drill 0.3 pad 0.61)
  Top 0.305: v85.24,28.4 82.67,30.98 v74.75,30.98
  Bottom 0.305: v74.75,30.98 70.02,35.7 64.36,35.7 63.67,36.39 C8.1 | v85.24,28.4 85.75,27.9 86.4,27.9 R5.1 87.36,26.84 87.58,26.61 88.64,26.61 R3.1
N$22  (via drill 0.3 pad 0.61)
  other vias: 7.62,39.37
N$23  (via drill 0.3 pad 0.61)
  other vias: 13.34,39.37
N$25  (via drill 0.3 pad 0.61)
  other vias: 17.14,39.37
N$28  (via drill 0.3 pad 0.61)
  other vias: 12.7,13.97
N$31  (via drill 0.3 pad 0.61)
  other vias: 71.75,57.15
N$35  (via drill 0.3 pad 0.61)
  other vias: 98.42,1.27
N$37  (via drill 0.3 pad 0.61)
  other vias: 16.51,55.88
N$38  (via drill 0.3 pad 0.61)
  other vias: 12.7,10.16
N$39  (via drill 0.3 pad 0.61)
  other vias: 93.98,41.91
N$40  (via drill 0.3 pad 0.61)
  other vias: 98.42,16.51
N$41  (via drill 0.3 pad 0.61)
  other vias: 95.25,16.51
N$42  (via drill 0.3 pad 0.61)
  other vias: 98.42,19.68
N$43  (via drill 0.3 pad 0.61)
  other vias: 95.25,19.68
N$44  (via drill 0.3 pad 0.61)
  other vias: 97.79,41.91
N$45
  Bottom 0.457: F1.P$2 89.92,7.11 92.23,4.8 X4.1
N$47
  Bottom 0.305: Q1.1 80.99,15.05 79.38,16.67 IC1.6
N$48
  Bottom 0.305: 83.29,11.73 83.29,12.35 83.79,12.85 Q1.3 | 83.29,11.73 83.29,8.13 ZD1.6 | 83.29,11.73 80.64,11.73 IC1.2
N$52
  Bottom 0.305: R4.1 87.09,16 86.35,15.26 86.35,15.05 Q1.2
NRESET  (via drill 0.3 pad 0.61)
  Top 0.305: v13.65,32.55 13.47,32.55 CTX-DB.10
  Bottom 0.305: U$1.34 16.19,30.01 v13.65,32.55
RO-A  (via drill 0.3 pad 0.61)
  Top 0.305: U$2.D8 95.89,24.4 91.75,28.53 v89.08,28.53
  Bottom 0.305: RS485.1 88,28.98 88.45,28.53 v89.08,28.53
RST
  Bottom 0.305: IC2.3 36.55,48.39 36.55,42.84 37.35,42.04 39.38,42.04 41.59,39.83 U$1.17
RX1  (via drill 0.3 pad 0.61)
  Top 0.305: HMMOD-UART.5 76.31,50.24 76.45,50.1 76.45,40.91 76.11,40.56 74.46,40.56 74,40.1 68.48,40.1 65.02,36.64 59.61,36.64 50.54,27.57 v50.54,27.29
  Bottom 0.305: UART1.3 46.28,11.43 46.28,14.44 45.65,15.08 43.6,15.08 42.62,16.06 42.62,16.98 45.65,20.02 46.67,20.02 U$1.22 46.67,23.64 46.89,23.64 v50.54,27.29
RX-MAPLE  (via drill 0.3 pad 0.61)
  Top 0.305: U$2.TX0-1 66.75,33.02 65.32,33.02 64.21,31.91 64.21,31.65 63.37,30.81 62.32,30.81 v61.61,30.1 | UART0.3 37.19,11.43 36.27,11.43 35.2,12.5 31.29,12.5 v27.38,16.41
  Bottom 0.305: v61.61,30.1 47.61,30.1 40.32,22.82 40.32,11.82 39.93,11.43 UART0.3 | U$1.30 26.35,17.43 v27.38,16.41
RX_DBG  (via drill 0.3 pad 0.61)
  Top 0.305: v53.54,39.98 53.54,39.12 49.18,34.76 34.45,34.76 33.97,35.24 U$1.14
  Bottom 0.305: TX.1 51.94,41.44 53.41,39.98 v53.54,39.98 59.21,34.3 U$3.TX 64.05,33.2 69.16,33.2 71.46,30.9 71.46,21.02 65.79,15.35 65.79,14.74 65.96,14.57 65.96,12.06 65.33,11.43 DBG.3
SCK1  (via drill 0.3 pad 0.61)
  Top 0.305: v65.35,12.95 65.6,12.7 67.62,12.7 68.78,11.54 68.78,11.43 CC_X1.4 70.92,11.43 72.84,13.35 CC1.SCLK | U$1.28 31.43,21.42 35.23,17.63 54.49,17.63 v59.01,13.12 | CC0.SCLK 25.91,10.43 25.93,10.41 v26.07,10.41 | CC4.SCLK 74.88,49.23 71.22,49.23 70.92,49.53 70.38,49.53 CC_X3.4 68.58,48.26 67.06,48.26 62.31,43.52 62.31,43.12 61.06,41.86 58.57,41.86 58.38,41.67 53.22,41.67 51.59,40.04 42.29,40.04 40.32,38.07 40.32,36.03 39.53,35.24 36.02,35.24 35.38,35.88 35.38,38.41 35.54,38.57 35.54,44.75 34.56,45.72 33.98,45.72 32.82,46.88 32.82,46.99 CC_X2.4 27.16,46.99 26.67,46.5 CC2.SCLK
  Bottom 0.305: 30.41,23.64 30.41,30.65 30.36,30.71 30.36,44.66 31.62,45.92 31.75,45.92 CC_X2.4 | 30.41,23.64 28.44,23.64 27.82,23.02 27.82,17.04 27.99,16.87 27.99,15.32 26.07,13.4 v26.07,10.41 26.07,7.2 27.89,5.38 29.72,5.38 30.68,6.35 CC_X0.4 | 30.41,23.64 31.43,23.64 U$1.28 | v59.01,13.12 59.22,12.9 65.3,12.9 v65.35,12.95
SCK2
  Bottom 0.305: IC2.4 40.17,45.85 40.17,45.4 46.67,38.9 U$1.19
SCK-A
  Top 0.305: U$2.D13 90.81,39.64 75.17,39.64 74.3,38.77 74.3,37.23 72.79,35.72 61.41,35.72 54.61,28.92 NRF24L01+.5
SWCLK/TCK
  Top 0.305: U$1.10 23.81,35.24 22.41,33.83 16.46,33.83 15.65,33.02 15.65,30.92 13.47,28.74 CTX-DB.4
SWDIO/TMS
  Top 0.305: U$1.11 26.35,35.24 24.41,33.29 16.56,33.29 16.11,32.84 16.11,30.73 13.47,28.09 13.47,27.47 CTX-DB.2
SWO/TDO
  Top 0.305: CTX-DB.6 10.46,30.01 10.46,33.06 12.64,35.24 18.73,35.24 U$1.8
TDI
  Top 0.305: CTX-DB.8 13.47,31.28 13.47,31.5 16.67,34.7 20.73,34.7 21.27,35.24 U$1.9
TX1  (via drill 0.3 pad 0.61)
  Top 0.305: v65.08,37.64 54.76,37.64 40.5,23.38 40.5,20.66 41.15,20.02 44.13,20.02 U$1.23
  Bottom 0.305: v65.08,37.64 68.77,41.33 68.77,42.35 69.65,43.23 70.14,43.23 71.01,44.09 71.01,52.23 HMMOD-UART.6 | UART1.2 42.62,13.97 42.53,13.97 41.68,14.82 41.68,17.57 44.13,20.02 U$1.23
TX-MAPLE  (via drill 0.3 pad 0.61)
  Top 0.305: v42.32,15.07 41.22,13.97 UART0.2 37.19,13.97 36.27,13.97 35.2,15.04 31.51,15.04 29.4,17.14 23.37,17.14 22.85,17.66 22.85,20.87 U$1.31
  Bottom 0.305: v42.32,15.07 42.15,15.24 42.15,17.29 45.51,20.65 45.51,23.14 51.05,28.69 61.93,28.69 62.4,28.21 63.34,28.21 64.21,29.08 64.21,29.34 65.06,30.18 66.45,30.18 U$2.RX1-1
TX_DBG  (via drill 0.3 pad 0.61)
  Top 0.305: U$1.15 36.51,38.9 37.24,39.63 39.78,39.63 41.15,41 50.73,41 v50.98,41.24
  Bottom 0.305: 51.05,41.24 59.58,32.72 68.96,32.72 69.6,32.09 69.6,28.72 68.83,27.95 66.75,27.95 U$3.RX 65.48,25.73 65.33,25.57 65.33,13.97 DBG.2 | 51.05,41.24 51.05,45.72 RX.1 | 51.05,41.24 v50.98,41.24
VCC
  Top 0.457: 25.62,27.49 25.62,27.84 32.7,34.92 32.7,38.18 33.92,39.39 34.3,39.39 34.3,39.9 C5.+ 34.3,43.3 34.29,43.31 CC_X2.1 32.89,44.45 CC_X2.2 27.91,44.45 26.81,43.35 26.81,40.59 | U$2.VCC 78.11,36.34 69.48,27.72 63.98,27.72 U$3.VCC 60.49,29.13 60.33,29.13 C12.1 | CC1.VCC 73.58,19.35 73.57,19.36 C2.2 70,19.36 69.42,19.94 C7.2 67.69,18.76 66.58,18.76 65.68,17.86 65.68,16.51 | 20.11,27.47 20.11,18.88 23.34,15.64 25.37,15.64 28.57,12.44 C10.+ | 25.62,27.49 20.13,27.49 20.11,27.47 | 20.11,27.47 19.45,27.47 CTX-DB.1 | 25.62,27.49 30.1,23.01 30.1,20.7 34.29,16.51 36.2,16.51 UART0.1 42.55,16.51 UART1.1 | 65.68,16.51 65.68,16.37 66.09,15.96 66.46,15.96 67.31,15.11 67.31,14.54 | 65.68,16.51 65.41,16.51 DBG.1 | CC_X3.1 68.45,52.07 CC_X3.2 69.85,54.42 71.26,55.83 C4.2 73.54,55.83 73.84,55.53 CC4.VCC | CC_X1.2 68.71,13.97 68.14,14.54 67.31,14.54 | CC_X1.1 67.31,14.54 | CC_X0.1 CC_X0.2 30.61,3.81 29.1,2.31 C1.2 26.81,2.31 25.98,3.13 25.98,4.43 CC0.VCC | CC2.VCC 26.75,40.5 26.75,40.53 26.81,40.59 | C3.2 26.81,40.59 | CHPD.1 41.05,56.64 41.05,55.73 42.31,54.47 ESP8266.VCC | U$1.40 0.95,19.94 1.59,19.3 C6.1
  Bottom 0.457: CC_X1.2 70.99,13.97 70.99,13.64 71.93,12.7 3V3.1 | 46.81,16.51 46.81,8.82 41.8,3.81 CC_X0.1 | 46.81,16.51 47.95,17.65 47.95,22.93 51.25,26.23 58.5,26.23 NRF24L01+.2 61.59,25.04 | 46.81,16.51 46.35,16.51 UART1.1 | 61.59,25.04 61.59,16.51 DBG.1 | U$3.VCC 61.59,25.34 61.59,25.04 | U$1.40 0.95,23.72 3.99,23.72 4.76,22.95 4.76,20.68 21.64,3.81 CC_X0.2 | 74.31,42.23 75.59,42.23 78.11,39.72 U$2.VCC | HMMOD-UART.1 74.31,42.23 | CC_X3.2 71.05,53.27 73.74,53.27 74.31,52.7 74.31,42.23 | 58.3,50.93 46.77,50.93 41.05,56.64 CHPD.1 | CC_X3.1 66.17,52.07 65.61,52.63 62.87,52.63 | 58.3,50.93 58.3,48.39 IC2.10 | C11.2 62.87,52.63 | 62.87,52.63 62.08,51.84 62.08,50.93 IC2.11 58.87,50.93 58.3,50.93
VDD
  Bottom 0.457: 93,28.98 94.69,28.98 95.25,29.54 C9.2 | 93,28.98 93,24.95 92.3,24.24 92.3,20.32 90.98,19 R1.1 89.95,17.87 | RS485.8 93,28.98 | X7.1 75.39,5.62 75.39,8.89 5V.1 3V3.2 75.39,12.7 77.19,14.5 81.37,14.5 81.92,13.95 | 81.92,13.95 84.3,13.95 84.53,14.19 84.53,16.45 85.95,17.87 | IC1.1 81.92,13.95 | 89.95,17.87 85.95,17.87 | 89.95,17.87 89.95,16.98 R4.2 89.95,14.26 89.92,14.22 F1.P$1 | R2.1 85.95,17.87
WIZ_CS
  Bottom 0.305: IC2.5 40.17,43.31 45.4,38.08 45.4,36.07 46.23,35.24 49.21,35.24 U$1.20
WIZ_RST
  Top 0.305: IC2.8 53.94,43.31 51.17,40.54 41.34,40.54 39.7,38.9 39.05,38.9 U$1.16

### Text on the board
tNames: GND | CS | CC3 | ESP-03 | VCC | MOSI | SCK | LAN | MISO | IN | VCC | CS | GND | VCC | GND | 5V | MAPLE CUN - large (A) | V1.3 www.neuby.de | 31 (PB12) | + | + | TX | TX | RX | RX | GND | GND | VCC
bNames: ESP->MAPLE | RS485 | 1Wire | MAPLE CUN Lage Version A 1.3 | VDD | GND | VDD | GND